# EAGLE design circle_gpio (EAGLE 7.4.0)
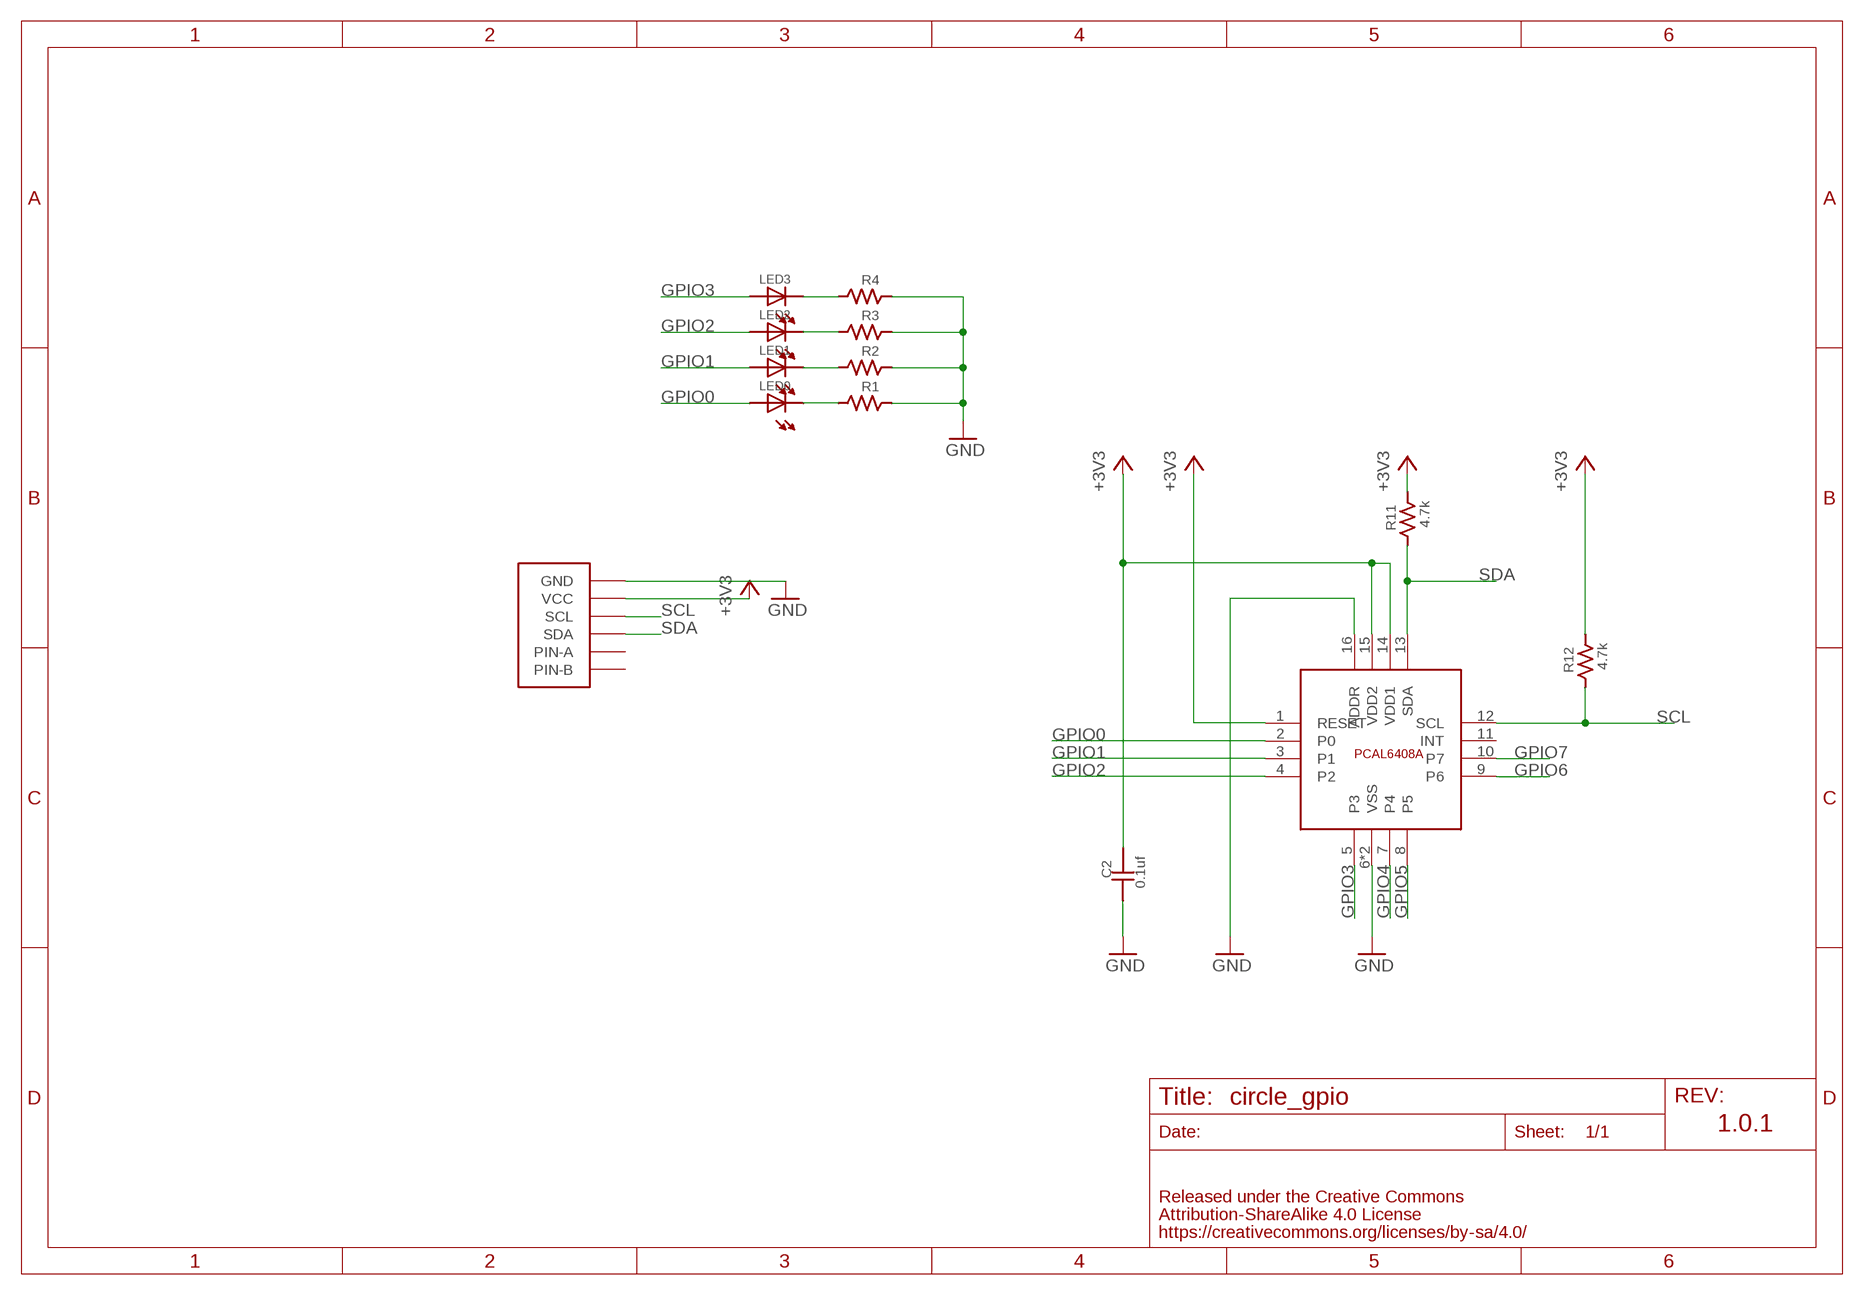
[diagram p0: schematic, sheet 1]

## Parts
C2  0.1uf  CAPACITOR0402  [0402]
LED0  LED0402  [0402]
LED1  LED0402  [0402]
LED2  LED0402  [0402]
LED3  LED0402  [0402]
R1  RESISTOR-0402  [0402]
R2  RESISTOR-0402  [0402]
R3  RESISTOR-0402  [0402]
R4  RESISTOR-0402  [0402]
R11  4.7k  RESISTOR-0402  [0402]
R12  4.7k  RESISTOR-0402  [0402]
U$3  FABO-NANO  [FABO-NANO]
U$5  NX-PCAL6408A  [NXP-PCAL6408A]

## Nets
111: C2.P$1 R1.P$2 R2.P$2 R3.P$2 R4.P$2 U$3.GND U$5.6(VSS) U$5.16(ADDR) U$5.17(VSS) ; supply symbol labelled GND
+3V3: C2.P$2 R11.P$2 R12.P$2 U$3.VCC U$5.1(RESET) U$5.14(VDD1) U$5.15(VDD2)
GPIO0: LED0.ANODE U$5.2(P0)
GPIO1: LED1.ANODE U$5.3(P1)
GPIO2: LED2.ANODE U$5.4(P2)
GPIO3: LED3.ANODE U$5.5(P3)
GPIO4: U$5.7(P4)
GPIO5: U$5.8(P5)
GPIO6: U$5.9(P6)
GPIO7: U$5.10(P7)
N$5: LED3.CATHODE R4.P$1
N$6: LED2.CATHODE R3.P$1
N$7: LED1.CATHODE R2.P$1
N$8: LED0.CATHODE R1.P$1
SCL: R12.P$1 U$3.0(SCL) U$5.12(SCL)
SDA: R11.P$1 U$3.1(SDA) U$5.13(SDA)
Unconnected: U$3.2(PIN-A) U$3.3(PIN-B) U$5.11(INT)

## Notes on the sheet
- 1.0.1

## Library data of the parts
C2 = FaBo-Capacitor:CAPACITOR: CAPACITOR
LED0 LED1-LED3 = FaBo-LED:LED
R1-R4 R11 R12 = FaBo-Resistors:RESISTOR: RESISTOR
U$3 = FaBo-Template:FABO-NANO
U$5 = FaBo-Mems:NX-PCAL6408A: NXP PCAL6408A

## Board
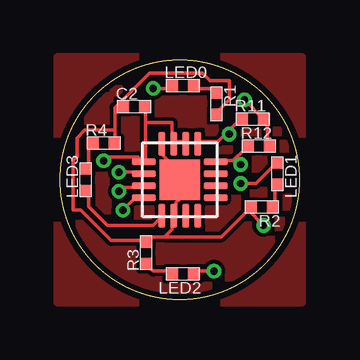
[diagram p1: board, top side]
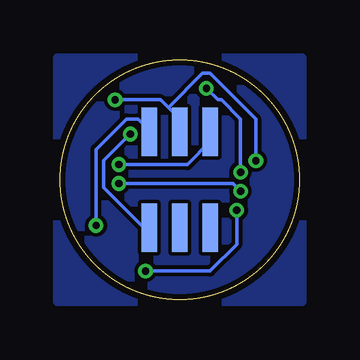
[diagram p2: board, bottom side, seen from below]

Size 10 x 10 mm. Coordinates in mm from the lower left corner, seen from the top.
Copper layers (1*16): Top 0.035mm / dielectric 1.5mm / Bottom 0.035mm
Design rules "SeeedStudio_2layer_DRU_no_angle_20140221": minimum track width 6mil, minimum drill 12mil, track to track 6mil, track to pad 6mil, pad to pad 6mil, via to via 6mil, smd to smd 0mil, copper to edge 10mil, drill to drill 10mil, minimum pad ring 10mil, minimum via ring 6mil, stop-mask expansion 2mil, vias tented up to drill 100mil, thermal gap 10mil

### Footprints (pad centres in the part's own frame; a part is rotated, then mirrored left to right if it is on the bottom)
0402 = smd 0.5 x 0.5: P$1 -0.46,0; P$2 0.46,0
0402' = smd 0.5 x 0.5: ANODE -0.46,0; CATHODE 0.46,0
FABO-NANO = smd 0.635 x 2.032 bottom: 0 -1.27,2; 1 1.27,-2; 2 0,-2; 3 -1.27,-2; GND 1.27,2; VCC 0,2
NXP-PCAL6408A = smd 1 x 0.3: 1 -1.5,0.75; 2 -1.5,0.25; 3 -1.5,-0.25; 4 -1.5,-0.75; 9 1.5,-0.75; 10 1.5,-0.25; 11 1.5,0.25; 12 1.5,0.75 | smd 0.3 x 1: 5 -0.75,-1.5; 6 -0.25,-1.5; 7 0.25,-1.5; 8 0.75,-1.5; 13 0.75,1.5; 14 0.25,1.5; 15 -0.25,1.5; 16 -0.75,1.5 | smd 1.7 x 1.7: 17 0,0

### Placement (x,y rotation side)
C2  3.09,8.05 0 top
LED0  [0402']  5.13,8.94 0 top
LED1  [0402']  9.06,5.25 270 top
LED2  [0402']  5.13,1.06 180 top
LED3  [0402']  1.06,5 90 top
R1  6.52,8.18 270 top
R2  8.43,3.86 180 top
R3  3.6,1.95 90 top
R4  1.82,6.52 0 top
R11  8.05,7.54 0 top
R12  8.3,6.4 0 top
U$3  5,5 0 top
U$5  5,5 0 top

### Tracks (layer width: path | path; a pad name or v marks a point on that pad's centre or on a via)
111  (via drill 0.3)
  Top 0.152: 2.3,8.02 2.3,7.06 | 2.3,7.06 2.3,6.59 R4.P$2 | 2.3,8.02 2.62,8.02 C2.P$1 | 2.3,8.02 3.73,9.45 5.95,9.45 6.27,9.13 7.06,9.13 7.06,8.33 6.59,7.86 R1.P$2 | U$5.16 4.21,6.43 4.21,6.11 5,5.32 U$5.17 5,4.21 4.84,4.05 4.84,3.57 U$5.6 4.68,3.41 4.68,2.94 4.37,2.62 | 4.37,2.62 3.89,2.62 3.73,2.46 R3.P$2 3.57,2.46 2.14,2.46 0.87,3.73 0.55,3.73 0.55,5.79 0.71,5.95 0.71,6.75 1.03,7.06 2.3,7.06 | 7.86,3.73 6.75,2.62 4.37,2.62 | 7.86,3.73 v8.49,3.09 | 7.86,3.73 R2.P$2
  Bottom 0.152: v8.49,3.09 8.49,6.27 7.22,7.54 6.75,7.54 6.27,7.06 U$3.GND
+3V3  (via drill 0.3)
  Top 0.152: U$5.14 5.16,6.59 4.84,6.59 U$5.15 4.68,6.59 4.68,7.38 3.57,7.38 | 3.57,7.38 3.57,5.79 U$5.1 3.41,5.79 3.25,5.95 1.98,5.95 v1.82,5.79 | 3.57,7.38 3.57,8.02 C2.P$2 | R12.P$2 8.65,6.43 8.65,7.54 R11.P$2 8.49,7.54 v7.7,8.33
  Bottom 0.152: v7.7,8.33 5.79,8.33 5.48,8.02 | 5.48,8.02 5,7.54 U$3.VCC | v1.82,5.79 1.82,7.54 3.73,9.45 4.05,9.45 5.48,8.02
GND
  pour Bottom: -0.08,-0.08 10.08,-0.08 10.08,10.08 -0.08,10.08
  pour Top: -0.08,-0.08 10.08,-0.08 10.08,10.08 -0.08,10.08
GPIO0  (via drill 0.3)
  Top 0.152: v3.89,8.81 4.52,8.81 LED0.ANODE | v2.46,5.32 3.41,5.32 U$5.2
  Bottom 0.152: v3.89,8.81 3.41,8.33 3.25,8.33 2.46,7.54 v2.46,5.32
GPIO1  (via drill 0.3)
  Top 0.152: v7.54,4.84 8.18,4.84 8.97,5.63 LED1.ANODE | v2.46,4.52 2.62,4.68 3.41,4.68 U$5.3
  Bottom 0.152: v7.54,4.84 2.78,4.84 v2.46,4.52
GPIO2  (via drill 0.3)
  Top 0.152: v6.43,1.19 5.63,1.19 LED2.ANODE | v2.62,3.73 3.09,4.21 3.41,4.21 U$5.4
  Bottom 0.152: v6.43,1.19 3.73,1.19 2.62,2.3 v2.62,3.73
GPIO3
  Top 0.152: LED3.ANODE 1.19,4.52 1.19,3.89 1.98,3.09 3.89,3.09 4.21,3.41 U$5.5
N$5
  Top 0.152: LED3.CATHODE 1.19,5.48 1.19,6.43 1.35,6.43 R4.P$1
N$6
  Top 0.152: R3.P$1 3.73,1.35 3.89,1.19 4.52,1.19 LED2.CATHODE
N$7
  Top 0.152: R2.P$1 8.97,3.89 8.97,4.68 LED1.CATHODE
N$8
  Top 0.152: R1.P$1 6.43,8.65 6.27,8.81 5.63,8.81 LED0.CATHODE
SCL  (via drill 0.3)
  Top 0.152: 7.22,5.79 7.7,6.27 R12.P$1 | 7.22,5.79 6.59,5.79 U$5.12 | 7.22,5.79 7.38,5.63 v7.54,5.63
  Bottom 0.152: v7.54,5.63 4.68,5.63 3.73,6.59 U$3.0
SDA  (via drill 0.3)
  Top 0.152: 7.06,7.06 6.59,6.59 5.79,6.59 U$5.13 | 7.06,7.06 7.54,7.54 R11.P$1 | v7.06,6.91 7.06,7.06
  Bottom 0.152: v7.06,6.91 8.18,5.79 8.18,4.68 6.59,3.09 6.27,3.09 U$3.1